# Altium schematic sheet Step Down.SchDoc
size A4
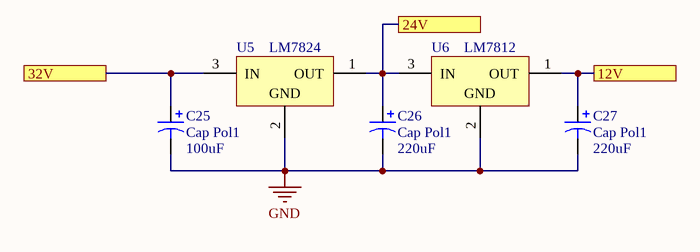
[diagram p0: Step Down.SchDoc]

## Parts
C25  Cap Pol1  value 100uF  [CAPR D250 H450 R100 mil]
C26  Cap Pol1  value 220uF  [CAPR D400 H500 R200 mil]
C27  Cap Pol1  value 220uF  [CAPR D250 H450 R100 mil]
U5  LM7824  [TO-220_B]
U6  LM7812  [TO-220_B]

## Ports
12V, 24V, 32V

## Nets
GND: C25.2 C26.2 C27.2 U5.2(GND) U6.2(GND)
12V: C27.1 U6.1(OUT) ; port 12V
24V: C26.1 U5.1(OUT) U6.3(IN) ; port 24V
32V: C25.1 U5.3(IN) ; port 32V

## Library data of the parts
C25-C27 = Cap Pol1: Polarized Capacitor (Radial); Published: 8-Jun-2000; LatestRevisionDate: 17-Jul-2002; LatestRevisionNote: Re-released for DXP Platform.; PackageReference: RB7.6-15; Publisher: Altium Limited; PackageDescription: Polarized Capacitor (Radial); 2 Leads
U5 U6 = LM78L12ACZ: 3-Terminal Positive Regulators, 3-pin TO-92; Manufacturer: National Semiconductor; PackageTopMarking: NSXYTT*LM78L*12ACZ; PowerWise: N; CompType: LDO IC; Published: 4-Dec-2008; DatasheetVersion: Apr-2006; PackageVersion: revG, Sep-2000; PackageReference: Z03A; Publisher: Altium Limited; PackageDescription: TO-92, Molded, 3 Lead; Supplier 1: Farnell; Supplier Part Number 1: 9490272; PartNumber: LM78L12ACZ; RoHS: N; PinCount: 3; Code_JEDEC: TO-226-AA; ComponentLink1Description: LM78L12 Datasheet; ComponentLink1URL: http://www.national.com/ds/LM/LM78L12.pdf; ComponentLink2Description: LM78L12 Web Page; ComponentLink2URL: http://www.national.com/pf/LM/LM78L12.html; ComponentLink3Description: Z03A Package Page; ComponentLink3URL: http://www.national.com/packaging/folders/z03a.html